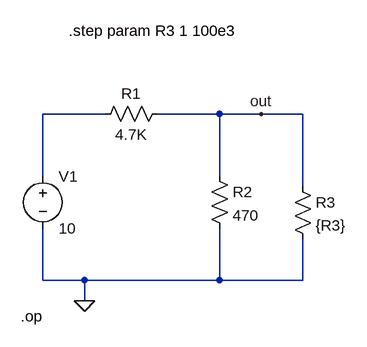
[diagram p0: schematic Draft1.asc]
Draft1.asc, the LTspice schematic file:
Version 4
SHEET 1 880 680
WIRE 176 32 80 32
WIRE 352 32 256 32
WIRE 416 32 352 32
WIRE 480 32 416 32
WIRE 80 128 80 32
WIRE 352 128 352 32
WIRE 480 144 480 32
WIRE 80 288 80 208
WIRE 144 288 80 288
WIRE 352 288 352 208
WIRE 352 288 144 288
WIRE 480 288 480 224
WIRE 480 288 352 288
WIRE 144 320 144 288
FLAG 144 320 0
FLAG 416 32 out
SYMBOL voltage 80 112 R0
WINDOW 123 0 0 Left 0
WINDOW 39 0 0 Left 0
SYMATTR InstName V1
SYMATTR Value 10
SYMBOL res 272 16 R90
WINDOW 0 0 56 VBottom 2
WINDOW 3 32 56 VTop 2
SYMATTR InstName R1
SYMATTR Value 4.7K
SYMBOL res 336 112 R0
SYMATTR InstName R2
SYMATTR Value 470
SYMBOL res 464 128 R0
SYMATTR InstName R3
SYMATTR Value {R3}
TEXT 120 -96 Left 2 !.step param R3 1 100e3
TEXT 46 344 Left 2 !.op

The netlist it stands for:
* Draft1.asc
V1 N001 0 10
R1 out N001 4.7K
R2 out 0 470
R3 out 0 {R3}
.step param R3 1 100e3
.op
.backanno
.end